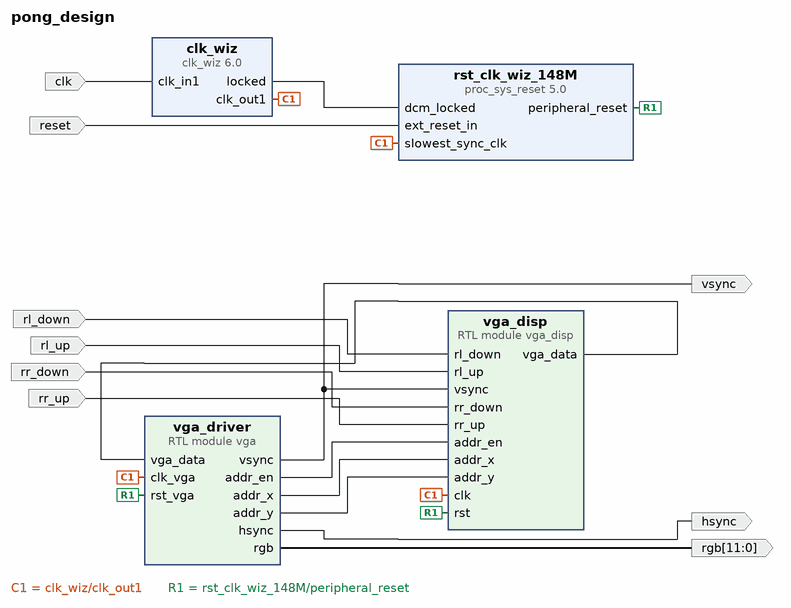
[diagram p0: block diagram of the top level]
# Vivado block design pong_design, xc7a35tcpg236-1, Vivado 2022.2
create_bd_design pong_design

create_bd_port -dir O -type data vsync
create_bd_port -dir O hsync
create_bd_port -dir O -from 11 -to 0 rgb
create_bd_port -dir I rl_down
create_bd_port -dir I rl_up
create_bd_port -dir I rr_down
create_bd_port -dir I rr_up
create_bd_port -dir I -type clk clk
set_property -dict {CONFIG.CLK_DOMAIN pong_design_sys_clock CONFIG.FREQ_HZ 100000000} [get_bd_ports clk]
create_bd_port -dir I -type rst reset
set_property -dict {CONFIG.POLARITY ACTIVE_HIGH} [get_bd_ports reset]

create_bd_cell -type ip -vlnv xilinx.com:ip:clk_wiz:6.0 clk_wiz
set_property -dict [list \
  CONFIG.CLKOUT1_JITTER 217.614 \
  CONFIG.CLKOUT1_PHASE_ERROR 245.344 \
  CONFIG.CLKOUT1_REQUESTED_OUT_FREQ 148.5 \
  CONFIG.CLK_IN1_BOARD_INTERFACE Custom \
  CONFIG.MMCM_CLKFBOUT_MULT_F 37.125 \
  CONFIG.MMCM_CLKOUT0_DIVIDE_F 6.250 \
  CONFIG.MMCM_DIVCLK_DIVIDE 4 \
  CONFIG.RESET_BOARD_INTERFACE Custom \
  CONFIG.USE_BOARD_FLOW true \
  CONFIG.USE_RESET false \
] [get_bd_cells clk_wiz]
create_bd_cell -type ip -vlnv xilinx.com:ip:proc_sys_reset:5.0 rst_clk_wiz_148M
set_property -dict {CONFIG.RESET_BOARD_INTERFACE Custom CONFIG.USE_BOARD_FLOW true} [get_bd_cells rst_clk_wiz_148M]
create_bd_cell -type module -reference vga vga_driver
create_bd_cell -type module -reference vga_disp vga_disp

# ---- connections ----

connect_bd_net [get_bd_ports clk] [get_bd_pins clk_wiz/clk_in1]
connect_bd_net [get_bd_pins clk_wiz/clk_out1] \
  [get_bd_pins rst_clk_wiz_148M/slowest_sync_clk] [get_bd_pins vga_driver/clk_vga] [get_bd_pins vga_disp/clk]
connect_bd_net [get_bd_pins clk_wiz/locked] [get_bd_pins rst_clk_wiz_148M/dcm_locked]
connect_bd_net [get_bd_ports reset] [get_bd_pins rst_clk_wiz_148M/ext_reset_in]
connect_bd_net [get_bd_ports rl_down] [get_bd_pins vga_disp/rl_down]
connect_bd_net [get_bd_ports rl_up] [get_bd_pins vga_disp/rl_up]
connect_bd_net [get_bd_ports rr_down] [get_bd_pins vga_disp/rr_down]
connect_bd_net [get_bd_ports rr_up] [get_bd_pins vga_disp/rr_up]
connect_bd_net [get_bd_pins rst_clk_wiz_148M/peripheral_reset] [get_bd_pins vga_driver/rst_vga] [get_bd_pins vga_disp/rst]
connect_bd_net -net vga_addr_en [get_bd_pins vga_driver/addr_en] [get_bd_pins vga_disp/addr_en]
connect_bd_net -net vga_addr_x [get_bd_pins vga_driver/addr_x] [get_bd_pins vga_disp/addr_x]
connect_bd_net -net vga_addr_y [get_bd_pins vga_driver/addr_y] [get_bd_pins vga_disp/addr_y]
connect_bd_net -net vga_disp_0_vga_data [get_bd_pins vga_disp/vga_data] [get_bd_pins vga_driver/vga_data]
connect_bd_net -net vga_hsync [get_bd_pins vga_driver/hsync] [get_bd_ports hsync]
connect_bd_net -net vga_rgb [get_bd_pins vga_driver/rgb] [get_bd_ports rgb]
connect_bd_net -net vga_vsync [get_bd_pins vga_driver/vsync] [get_bd_ports vsync] [get_bd_pins vga_disp/vsync]

validate_bd_design
save_bd_design
